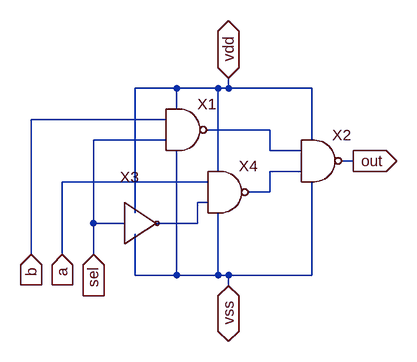
[diagram p0: schematic mux.asc]
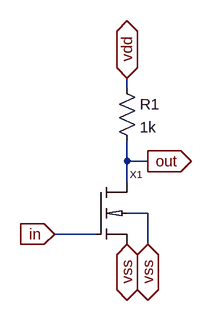
[diagram p1: sub-circuit not.asc]
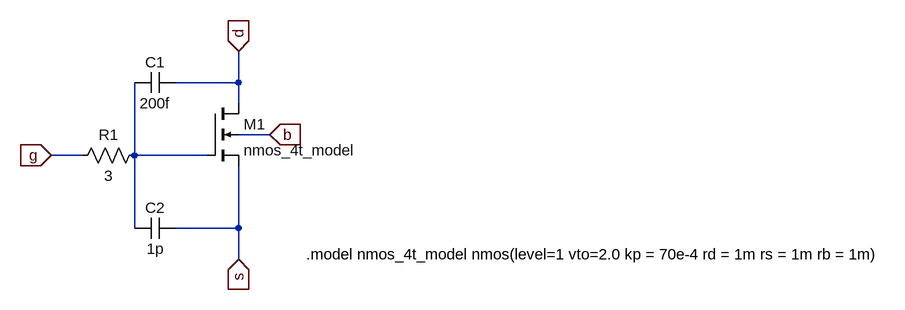
[diagram p2: sub-circuit nmos_4t.asc]
mux.asc, the LTspice schematic file:
Version 4
SHEET 1 880 680
WIRE 112 32 48 32
WIRE 176 32 112 32
WIRE 192 32 192 16
WIRE 192 32 176 32
WIRE 320 32 192 32
WIRE 112 64 112 32
WIRE 96 80 -112 80
WIRE 256 96 160 96
WIRE 96 112 -16 112
WIRE 320 112 320 32
WIRE 256 128 256 96
WIRE 304 128 256 128
WIRE 384 144 368 144
WIRE 176 160 176 32
WIRE 304 160 256 160
WIRE 160 176 -64 176
WIRE 256 192 256 160
WIRE 256 192 224 192
WIRE 160 208 144 208
WIRE 48 224 48 32
WIRE -16 240 -16 112
WIRE 32 240 -16 240
WIRE 144 240 144 208
WIRE 144 240 80 240
WIRE -112 288 -112 80
WIRE -64 288 -64 176
WIRE -16 288 -16 240
WIRE 48 320 48 256
WIRE 112 320 112 128
WIRE 112 320 48 320
WIRE 176 320 176 224
WIRE 176 320 112 320
WIRE 192 320 176 320
WIRE 320 320 320 176
WIRE 320 320 192 320
WIRE 192 336 192 320
FLAG -64 288 a
IOPIN -64 288 In
FLAG -112 288 b
IOPIN -112 288 In
FLAG -16 288 sel
IOPIN -16 288 In
FLAG 192 336 vss
IOPIN 192 336 BiDir
FLAG 192 16 vdd
IOPIN 192 16 BiDir
FLAG 384 144 out
IOPIN 384 144 Out
SYMBOL not 32 240 R0
SYMATTR InstName X3
SYMBOL nand 128 32 R0
SYMATTR InstName X1
SYMBOL nand 336 80 R0
SYMATTR InstName X2
SYMBOL nand 192 128 R0
SYMATTR InstName X4

not.asc, the sub-circuit schematic file:
Version 4
SHEET 1 880 680
WIRE 176 -96 176 -112
WIRE 176 16 176 -16
WIRE 208 16 176 16
WIRE 176 48 176 16
WIRE 208 96 176 96
WIRE 128 128 64 128
WIRE 208 144 208 96
FLAG 64 128 in
IOPIN 64 128 In
FLAG 176 144 vss
IOPIN 176 144 BiDir
FLAG 176 -112 vdd
IOPIN 176 -112 BiDir
FLAG 208 16 out
IOPIN 208 16 Out
FLAG 208 144 vss
IOPIN 208 144 BiDir
SYMBOL res 160 -112 R0
SYMATTR InstName R1
SYMATTR Value 1k
SYMBOL nmos_4t 128 48 R0
SYMATTR InstName X1

nmos_4t.asc, the sub-circuit schematic file:
Version 4
SHEET 1 880 680
WIRE -288 -224 -288 -272
WIRE -288 -224 -384 -224
WIRE -288 -192 -288 -224
WIRE -240 -144 -288 -144
WIRE -528 -112 -576 -112
WIRE -448 -112 -448 -224
WIRE -336 -112 -448 -112
WIRE -448 0 -448 -112
WIRE -288 0 -288 -96
WIRE -288 0 -384 0
WIRE -288 48 -288 0
FLAG -576 -112 g
IOPIN -576 -112 In
FLAG -288 -272 d
IOPIN -288 -272 In
FLAG -288 48 s
IOPIN -288 48 In
FLAG -240 -144 b
IOPIN -240 -144 In
SYMBOL nmos4 -336 -192 R0
SYMATTR InstName M1
SYMATTR Value nmos_4t_model
SYMBOL cap -384 -240 R90
WINDOW 0 0 32 VBottom 2
WINDOW 3 32 32 VTop 2
SYMATTR InstName C1
SYMATTR Value 200f
SYMBOL cap -384 -16 R90
WINDOW 0 0 32 VBottom 2
WINDOW 3 32 32 VTop 2
SYMATTR InstName C2
SYMATTR Value 1p
SYMBOL res -432 -128 R90
WINDOW 0 0 56 VBottom 2
WINDOW 3 32 56 VTop 2
SYMATTR InstName R1
SYMATTR Value 3
TEXT -184 40 Left 2 !.model nmos_4t_model nmos(level=1 vto=2.0 kp = 70e-4 rd = 1m rs = 1m rb = 1m)

The netlist it stands for:
* mux.asc
XX3 sel N003 vss vdd not
XX1 b sel vdd vss N001 nand  ; pins a b vdd vss out
XX2 N001 N002 vdd vss out nand  ; pins a b vdd vss out
XX4 a N003 vdd vss N002 nand  ; pins a b vdd vss out

* block symbol definitions
.subckt not in out vss vdd
R1 vdd out 1k
XX1 out in vss vss nmos_4t
.ends not

.subckt nmos_4t D G S B
M1 d N001 s b nmos_4t_model
C1 d N001 200f
C2 s N001 1p
R1 N001 g 3
.model nmos_4t_model nmos(level=1 vto=2.0 kp = 70e-4 rd = 1m rs = 1m rb = 1m)
.ends nmos_4t

.model NMOS NMOS
.model PMOS PMOS
.lib standard.mos
.backanno
.end